# EAGLE design 3pin-breakout (EAGLE 6.6.0)
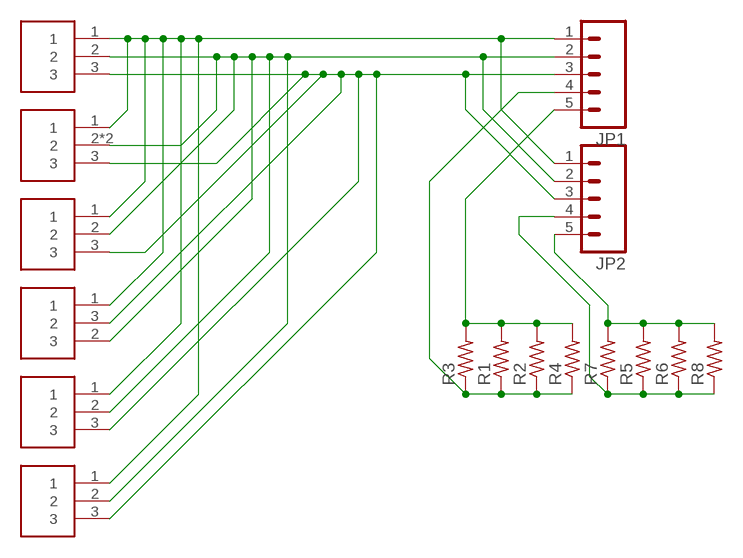
[diagram p0: schematic, sheet 1]

## Parts
JP1  M05PTH  [1X05]
JP2  M05PTH  [1X05]
R1  RESISTORR0805  [R0805]
R2  RESISTORR1206  [R1206]
R3  RESISTORR0805  [R0805]
R4  RESISTORR1206  [R1206]
R5  RESISTORR0805  [R0805]
R6  RESISTORR1206  [R1206]
R7  RESISTORR0805  [R0805]
R8  RESISTORR1206  [R1206]
U$1  BLANK-3PINSOT23  [SOT-23]
U$2  BLANK-3PINSOT223  [SOT-223]
U$3  BLANK-3PINSOT323  [SC70]
U$4  BLANK-3PINSOT416  [SC75_INFINEON]
U$5  BLANK-3PINTO252  [TO252]
U$6  BLANK-3PINTO263  [TO263]

## Nets
N$1: JP1.1 JP2.1 U$1.1 U$2.1 U$3.1 U$4.1 U$5.1 U$6.1
N$2: JP1.2 JP2.2 U$1.2 U$2.2 U$2.4 U$3.2 U$4.2 U$5.2 U$6.2
N$3: JP1.3 JP2.3 U$1.3 U$2.3 U$3.3 U$4.3 U$5.3 U$6.3
N$4: JP1.5 R1.2 R2.2 R3.2 R4.2
N$5: JP1.4 R1.1 R2.1 R3.1 R4.1
N$6: JP2.5 R5.2 R6.2 R7.2 R8.2
N$7: JP2.4 R5.1 R6.1 R7.1 R8.1

## Library data of the parts
JP1 JP2 = iStivi - Header-Connector:M05: Header 5 Standard 5-pin 0.1" header. Use with straight break away headers (SKU : PRT-00116), right angle break away headers (PRT-00553), swiss pins (PRT-00743), machine pins (PRT-00117), and female headers (PRT-00115). Molex polarized connector foot print use with SKU : PRT-08230 with associated crimp pins and housings.
R1-R8 = iStivi - RCLD:RESISTOR: RESISTOR
U$1-U$6 = iStivi - Transistor-FET-reg:BLANK-3PIN

## Board
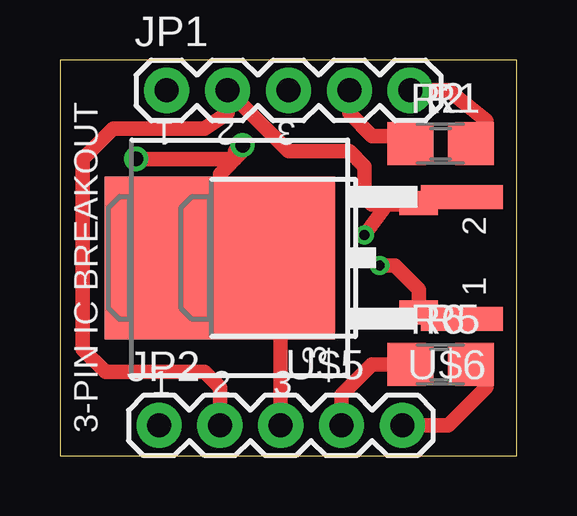
[diagram p1: board, top side]
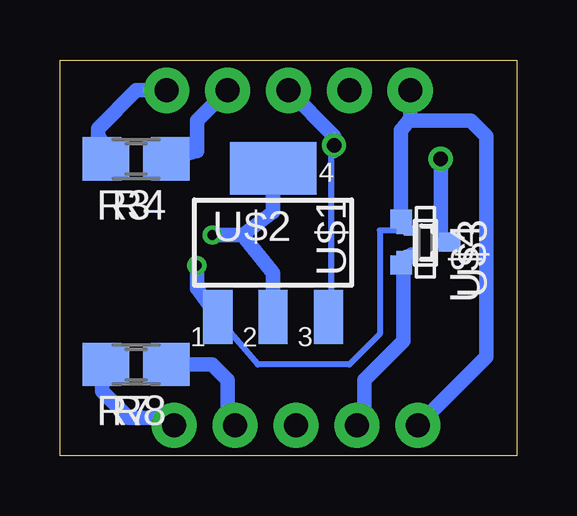
[diagram p2: board, bottom side, seen from below]

Size 19.05 x 16.51 mm. Coordinates in mm from the lower left corner, seen from the top.
Outline: 0,0 19.05,0 19.05,16.51 0,16.51 0,0
Copper layers (1*16): Top 0.035mm / dielectric 1.5mm / Bottom 0.035mm
Design rules "default *": minimum track width 10mil, minimum drill 0.6mm, track to track 8mil, track to pad 8mil, pad to pad 8mil, via to via 8mil, smd to smd 8mil, copper to edge 40mil, drill to drill 8mil, minimum pad ring 10mil, minimum via ring 8mil, stop-mask expansion 4mil, vias tented up to drill 0.6mm, thermal gap 10mil

### Footprints (pad centres in the part's own frame; a part is rotated, then mirrored left to right if it is on the bottom)
1X05 = drill 1 pad 1.88: 1 0,0; 2 2.54,0; 3 5.08,0; 4 7.62,0; 5 10.16,0
R0805 = smd 1.3 x 1.5: 1 -0.95,0; 2 0.95,0
R1206 = smd 1.6 x 1.803: 1 -1.422,0; 2 1.422,0
SOT-23 = smd 0.787 x 0.889: 1 0.991,1.016; 2 -0.94,1.016; 3 0.025,-1.016
SOT-223 = smd 1.219 x 2.235: 1 -2.311,-3.099; 2 0,-3.099; 3 2.311,-3.099 | smd 3.6 x 2.2: 4 0,3.099
SC70 = smd 0.6 x 0.55: 1 -0.65,-0.925; 2 0.65,-0.925; 3 0,0.925
SC75_INFINEON = smd 0.4 x 0.65: 1 -0.5,-0.575; 2 0.5,-0.575; 3 0,0.575
TO252 = smd 1 x 1.6: 1 -2.28,-4.8; 2 2.28,-4.8 | smd 5.4 x 6.2: 3 0,2.5
TO263 = smd 1 x 3.4: 1 -2.54,-6.6; 2 2.54,-6.6 | smd 6.8 x 9.6: 3 0,3.5

### Placement (x,y rotation side)
JP1  4.45,15.24 0 top
JP2  4.13,1.27 0 top
R1  15.88,13.02 0 top
R2  15.88,13.02 0 top
R3  15.88,12.38 180 bottom
R4  15.88,12.38 180 bottom
R5  15.88,3.81 0 top
R6  15.88,3.81 0 top
R7  15.88,3.81 180 bottom
R8  15.88,3.81 180 bottom
U$1  3.81,8.89 90 bottom
U$2  10.16,8.89 0 bottom
U$3  3.81,8.89 270 bottom
U$4  3.81,8.89 270 bottom
U$5  10.16,8.26 90 top
U$6  10.16,8.26 90 top
U$7  [BUZZBOY-SILK-BOTTOM]  15.88,7.62 90 top

### Tracks (layer width: path | path; a pad name or v marks a point on that pad's centre or on a via)
N$1  (via drill 0.4)
  Top 0.61: 15.22,6.03 U$5.1 | U$6.1 15.22,5.71 U$5.1 | v13.34,7.94 13.97,7.94 14.96,6.95 U$5.1
  Bottom 0.254: U$2.1 12.32,5.59 10.79,3.81 6.99,3.81 5.71,5.08 5.71,9.4 4.7,9.4 U$3.1
  Bottom 0.305: U$4.1 4.38,9.44 U$1.1 4.83,9.63 U$3.1
  Bottom 0.61: JP1.1 4.45,14.07 | 4.45,14.07 4.76,13.65 4.83,13.59 U$1.1 | U$2.1 13.34,6.99 v13.34,7.94 | JP2.1 1.27,4.13 1.27,13.34 1.91,13.97 4.45,13.97 4.45,14.07
N$2  (via drill 0.4)
  Top 0.61: U$6.2 15.86,10.79 U$5.2 | U$5.2 15.24,10.79 14.92,10.48 13.63,10.48 | 13.63,10.48 13.02,10.48 12.7,10.79 12.7,12.06 12.06,12.7 9.53,12.7 JP1.2 6.99,14.29 6.03,13.65 2.22,13.65 0.95,12.38 0.95,4.45 1.91,3.49 6.03,3.49 6.67,2.86 JP2.2 | v12.7,9.21 13.63,10.48 | 13.63,10.48 U$5.2
  Bottom 0.305: U$1.2 4.83,8.15 U$3.2
  Bottom 0.61: 11.43,9.21 10.16,7.62 U$2.2 | U$2.4 10.16,10.16 11.43,9.21 | 11.43,9.21 v12.7,9.21 | U$3.2 4.74,4.79 6.35,3.17 6.35,1.59 JP2.2 | U$1.2 U$4.2
N$3  (via drill 0.6)
  Top 0.254: U$6.3 U$5.3 | v7.62,12.95 7.62,12.7
  Top 0.61: 7.62,12.7 6.67,11.75 U$6.3 9.21,6.34 JP2.3 | v3.17,12.38 7.3,12.38 7.3,12.7 7.37,12.7 v7.62,12.95
  Bottom 0.254: U$2.3 7.75,5.84 7.75,12.45 7.62,12.7
  Bottom 0.61: U$4.3 U$3.3 | U$1.3 3.21,8.91 U$4.3 | JP1.3 7.62,13.34 v7.62,12.95 7.62,12.7 | U$4.3 3.17,8.89 v3.17,12.38
N$4
  Top 0.254: R1.2 R2.2
  Top 0.61: JP1.5 16.19,15.24 17.78,13.97 17.78,13.49 R2.2
  Bottom 0.254: R4.2 R3.2
  Bottom 0.61: R3.2 17.46,13.34 17.46,13.65 15.88,15.24 JP1.5
N$5
  Top 0.254: R1.1 15.24,13.34
  Top 0.61: JP1.4 12.06,14.29 13.02,13.34 13.65,13.34 R2.1 15.24,13.34
  Bottom 0.61: R3.1 R4.1 13.34,12.7 13.34,13.97 JP1.4
N$6
  Top 0.254: R5.2 R8.2
  Top 0.61: JP2.5 16.19,1.27 17.78,2.86 17.78,4.29 R8.2
  Bottom 0.254: R5.2 R8.2
  Bottom 0.61: R8.2 17.3,2.69 16.19,1.59 14.29,1.59 JP2.5
N$7
  Top 0.254: R7.1 R6.1
  Top 0.61: JP2.4 11.75,2.54 13.02,3.81 R6.1
  Bottom 0.254: R7.1 R6.1
  Bottom 0.61: R6.1 12.7,3.81 12.06,3.17 12.06,1.91 JP2.4

### Text on the board
_tsilk: 1 | 2 | 3 | 2 | 1 | 3 | 1 | 2 | 3 | 3-PIN IC BREAKOUT
_bsilk: 1 | 2 | 3 | 1 | 2 | 3 | 2 | 2 | 1 | 1 | 2 | 3 | 3